# EAGLE board Rocket32_TRASIO (EAGLE 9.6.2)
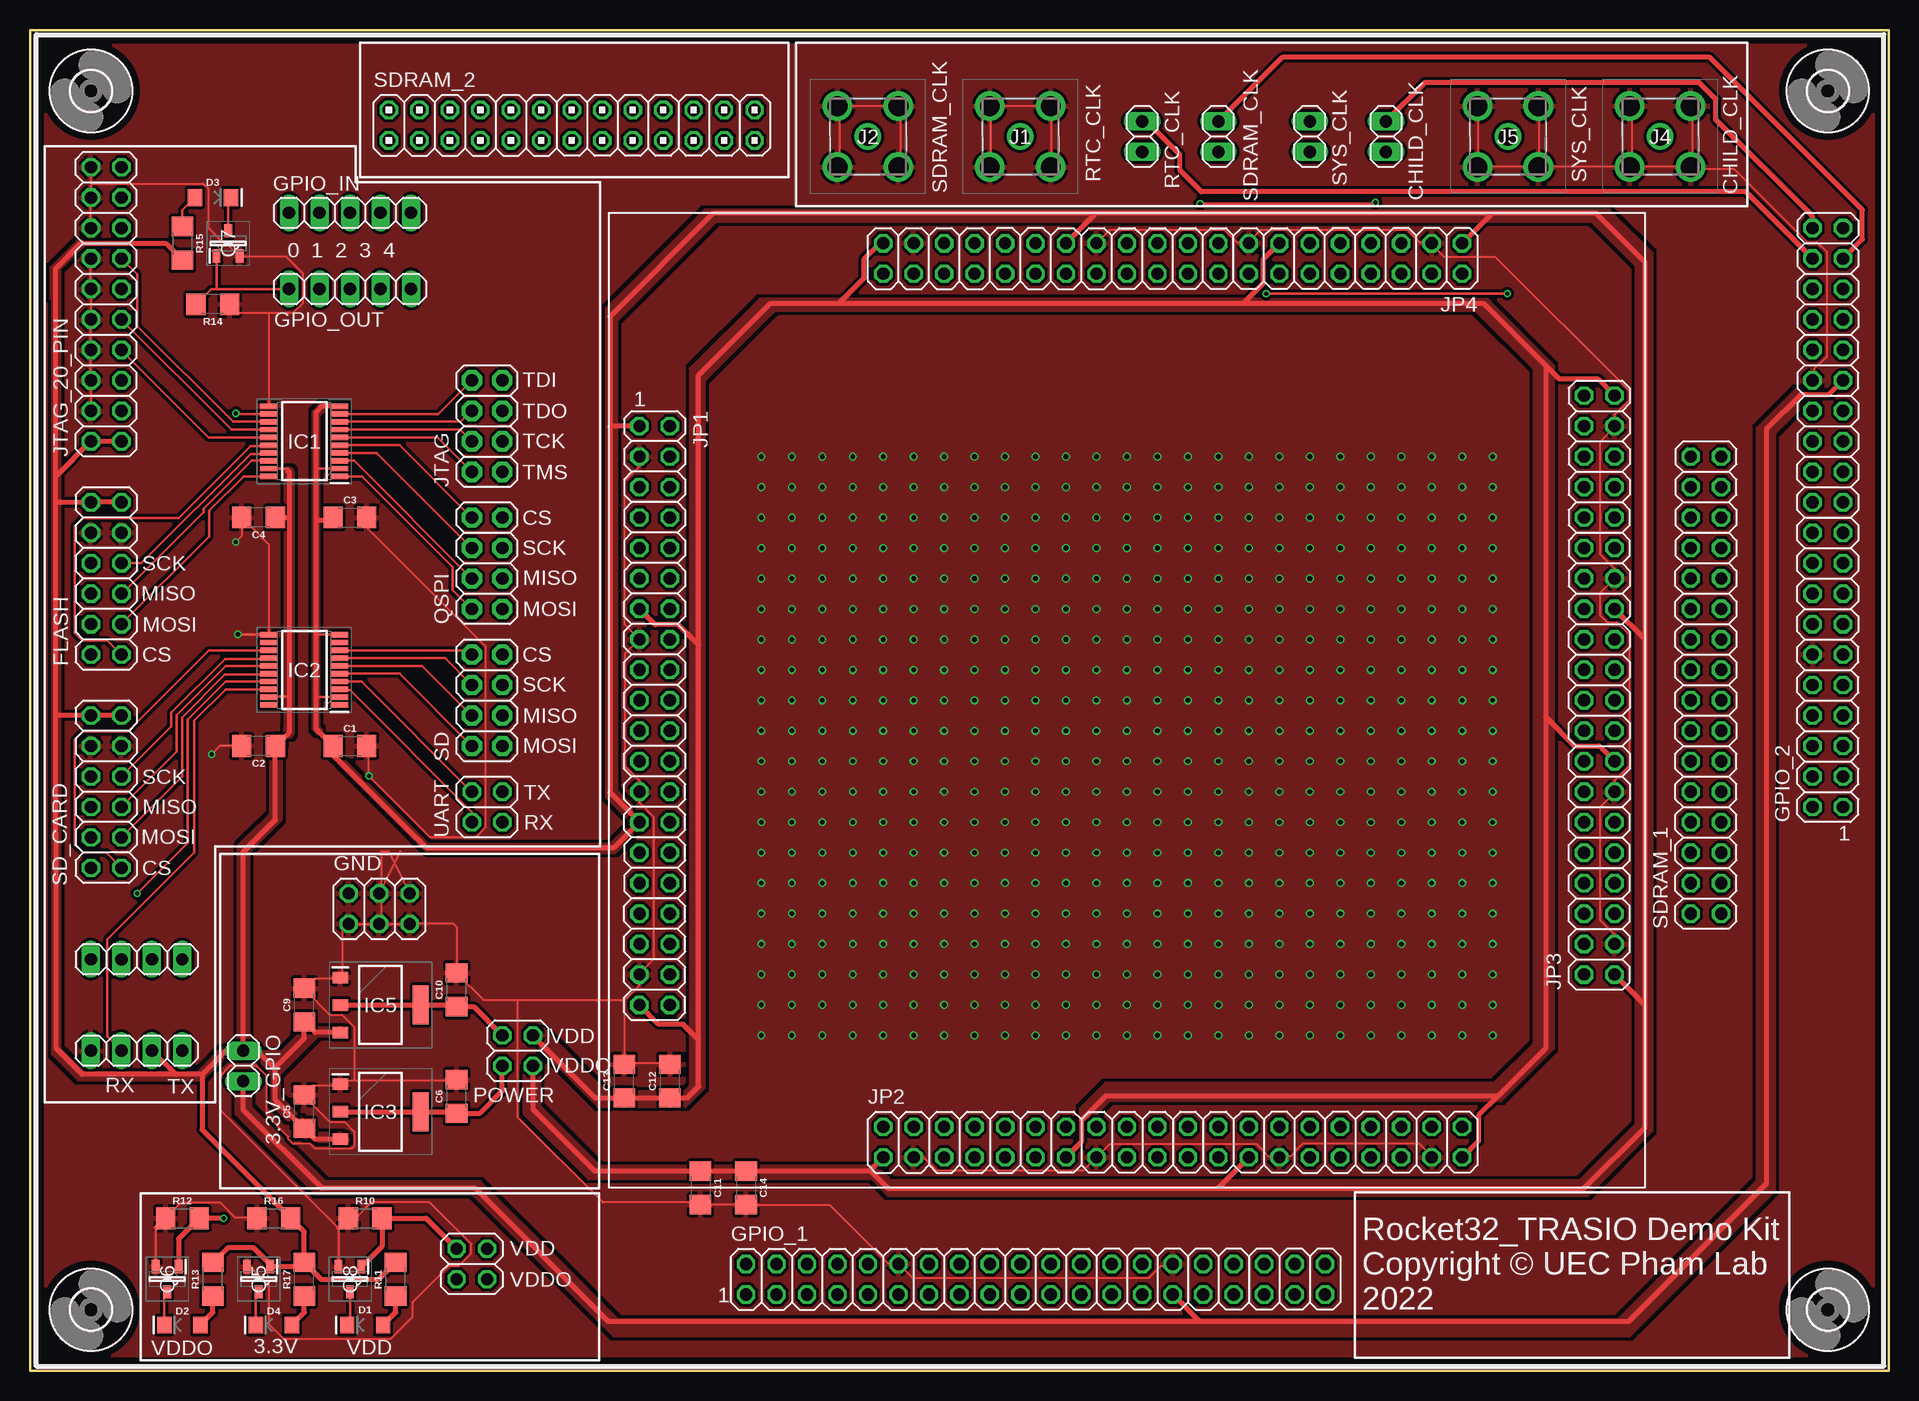
[diagram p2: board, top side]
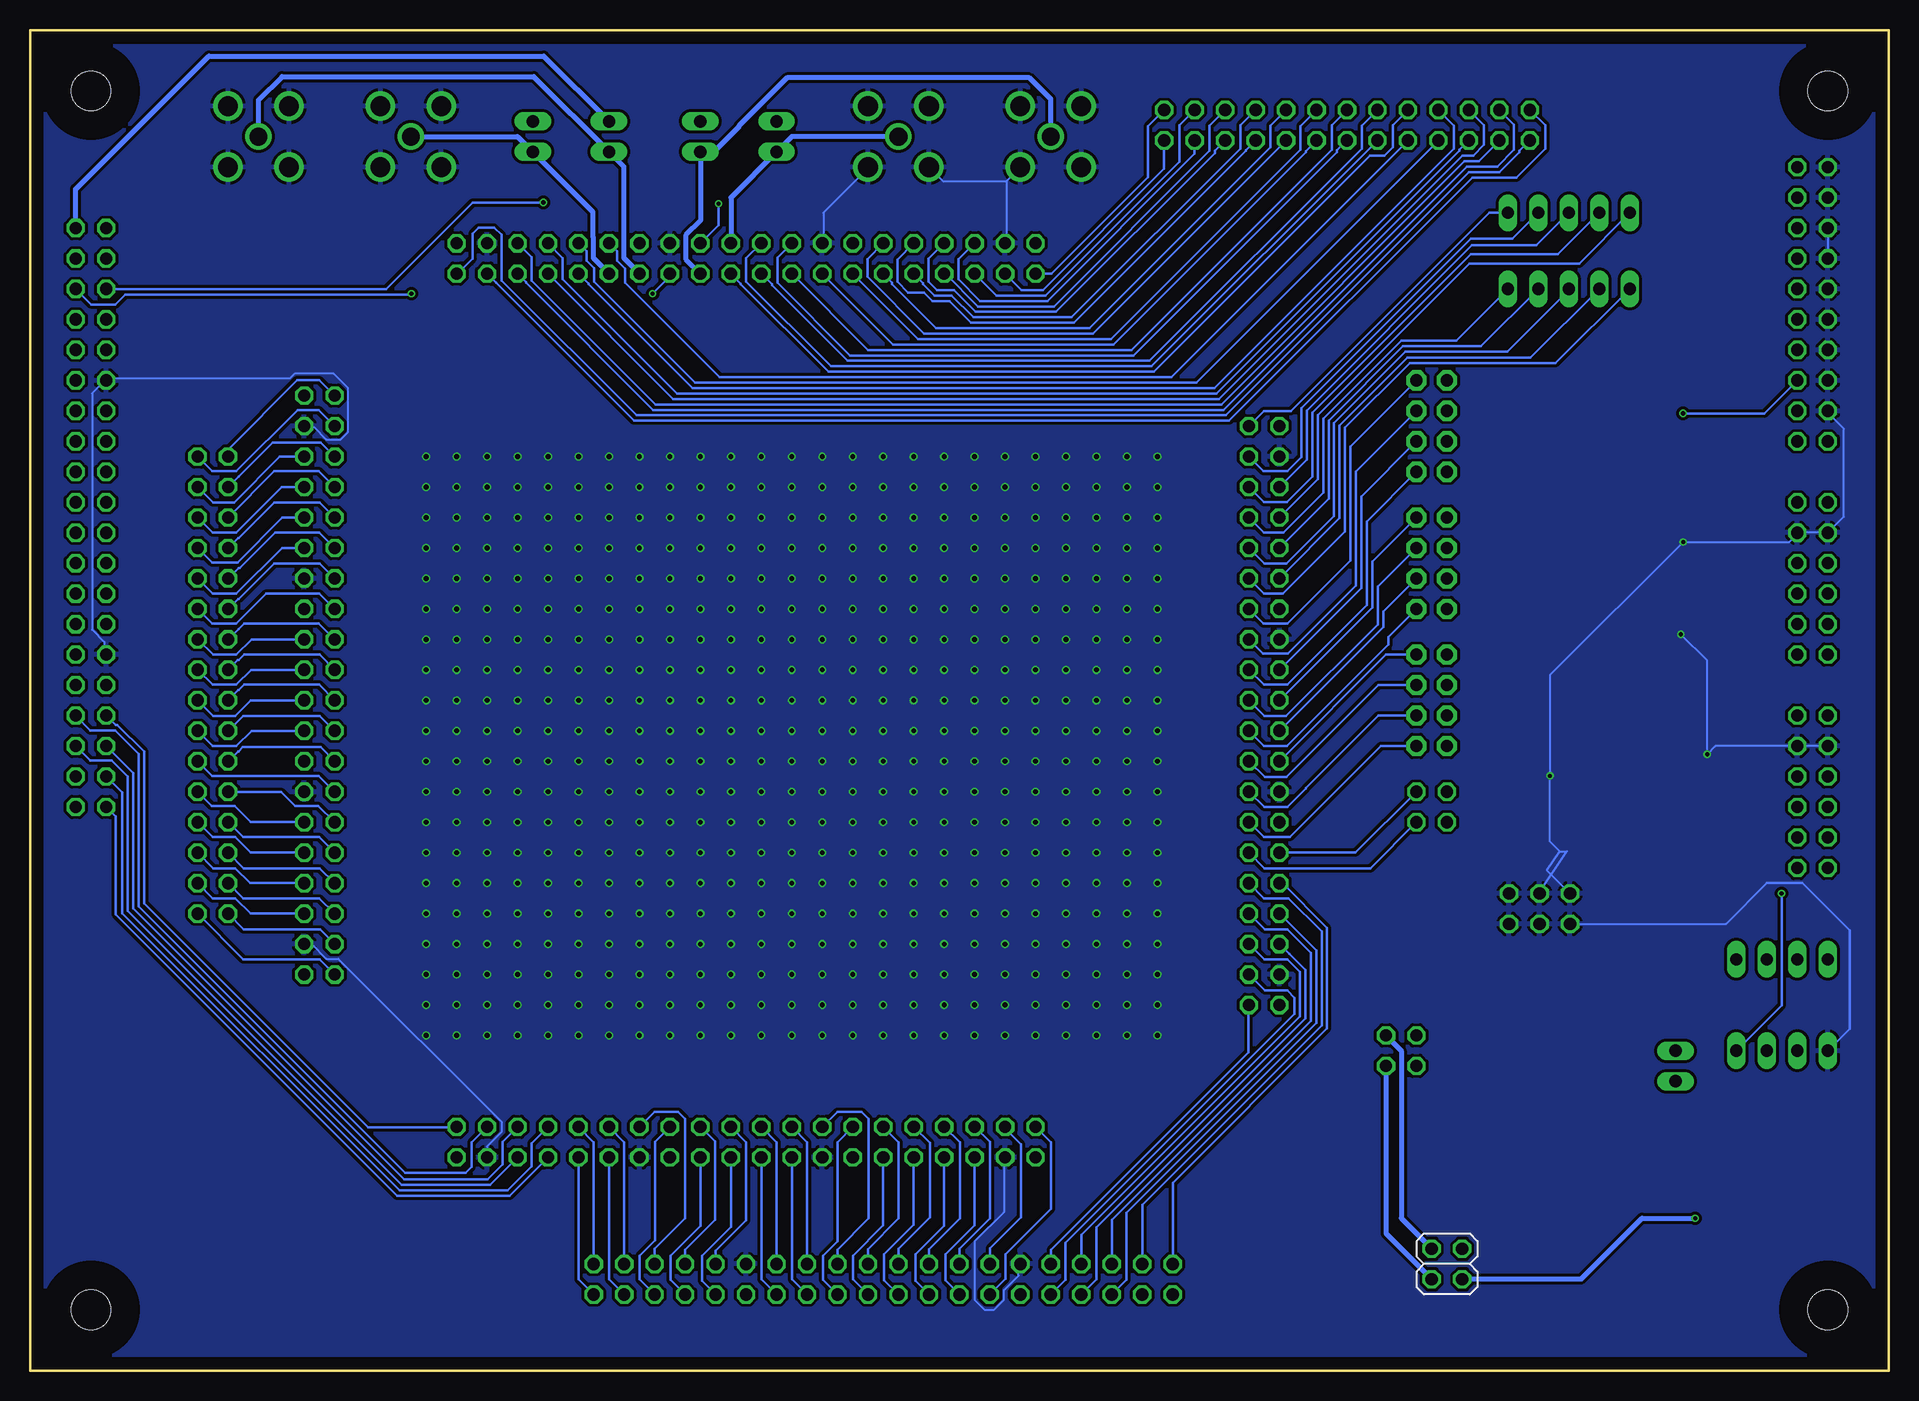
[diagram p3: board, bottom side, seen from below]

Size 154.94 x 111.76 mm. Coordinates in mm from the lower left corner, seen from the top.
Outline: 154.94,111.76 0,111.76 0,0 154.94,0 154.94,111.76
Copper layers (1*16): Top 0.035mm / dielectric 1.5mm / Bottom 0.035mm
Design rules "default *": minimum track width 6mil, minimum drill 0.35mm, track to track 10mil, track to pad 10mil, pad to pad 6mil, via to via 10mil, smd to smd 10mil, copper to edge 40mil, drill to drill 6mil, minimum pad ring 0.13mm, minimum via ring 0.13mm, stop-mask expansion 4mil, vias tented up to drill 0mil, thermal gap 10mil

## Footprints (pad centres in the part's own frame; a part is rotated, then mirrored left to right if it is on the bottom)
1X02 = drill 1.016 long: 1 -1.27,0; 2 1.27,0
1206 = smd 1.6 x 1.8: 1 -1.4,0; 2 1.4,0
LED-1206 = smd 1.2 x 1.4: A -1.5,0; C 1.5,0
2X06 = drill 1.016 octagon: 1 -6.35,-1.27; 2 -6.35,1.27; 3 -3.81,-1.27; 4 -3.81,1.27; 5 -1.27,-1.27; 6 -1.27,1.27; 7 1.27,-1.27; 8 1.27,1.27; 9 3.81,-1.27; 10 3.81,1.27; 11 6.35,-1.27; 12 6.35,1.27
2X03 = drill 1.016 octagon: 1 -2.54,-1.27; 2 -2.54,1.27; 3 0,-1.27; 4 0,1.27; 5 2.54,-1.27; 6 2.54,1.27
2X20 = drill 1.016 octagon: 1 -24.13,-1.27; 2 -24.13,1.27; 3 -21.59,-1.27; 4 -21.59,1.27; 5 -19.05,-1.27; 6 -19.05,1.27; 7 -16.51,-1.27; 8 -16.51,1.27; 9 -13.97,-1.27; 10 -13.97,1.27; 11 -11.43,-1.27; 12 -11.43,1.27; 13 -8.89,-1.27; 14 -8.89,1.27; 15 -6.35,-1.27; 16 -6.35,1.27; 17 -3.81,-1.27; 18 -3.81,1.27; 19 -1.27,-1.27; 20 -1.27,1.27; 21 1.27,-1.27; 22 1.27,1.27; 23 3.81,-1.27; 24 3.81,1.27; 25 6.35,-1.27; 26 6.35,1.27; 27 8.89,-1.27; 28 8.89,1.27; 29 11.43,-1.27; 30 11.43,1.27; 31 13.97,-1.27; 32 13.97,1.27; 33 16.51,-1.27; 34 16.51,1.27; 35 19.05,-1.27; 36 19.05,1.27; 37 21.59,-1.27; 38 21.59,1.27; 39 24.13,-1.27; 40 24.13,1.27
1X05 = drill 1.016 long: 1 -5.08,0; 2 -2.54,0; 3 0,0; 4 2.54,0; 5 5.08,0
3,3 = hole 3.3: 0,0
SOP65P640X120-20N = smd 1.475 x 0.45: 1 -2.938,2.925; 2 -2.938,2.275; 3 -2.938,1.625; 4 -2.938,0.975; 5 -2.938,0.325; 6 -2.938,-0.325; 7 -2.938,-0.975; 8 -2.938,-1.625; 9 -2.938,-2.275; 10 -2.938,-2.925; 11 2.938,-2.925; 12 2.938,-2.275; 13 2.938,-1.625; 14 2.938,-0.975; 15 2.938,-0.325; 16 2.938,0.325; 17 2.938,0.975; 18 2.938,1.625; 19 2.938,2.275; 20 2.938,2.925
SOT229P700X180-4N = smd 1.3 x 0.95: 1 -3.35,2.29; 2 -3.35,0; 3 -3.35,-2.29 | smd 1.3 x 3.25: 4 3.35,0
29856004 = drill 1.64 pad 2.46: 1 0,0; 2 5.08,0; 3 5.08,5.08; 4 0,5.08 | drill 1.47 pad 2.205: 5 2.54,2.54
2X04 = drill 1.016 pad 1.676 octagon: 1 -3.81,-1.27; 2 -3.81,1.27; 3 -1.27,-1.27; 4 -1.27,1.27; 5 1.27,-1.27; 6 1.27,1.27; 7 3.81,-1.27; 8 3.81,1.27
2X10 = drill 1.016 octagon: 1 -11.43,-1.27; 2 -11.43,1.27; 3 -8.89,-1.27; 4 -8.89,1.27; 5 -6.35,-1.27; 6 -6.35,1.27; 7 -3.81,-1.27; 8 -3.81,1.27; 9 -1.27,-1.27; 10 -1.27,1.27; 11 1.27,-1.27; 12 1.27,1.27; 13 3.81,-1.27; 14 3.81,1.27; 15 6.35,-1.27; 16 6.35,1.27; 17 8.89,-1.27; 18 8.89,1.27; 19 11.43,-1.27; 20 11.43,1.27
2X02 = drill 1.016 octagon: 1 -1.27,-1.27; 2 -1.27,1.27; 3 1.27,-1.27; 4 1.27,1.27
SOT96P240X100-3N = smd 1.1 x 0.65: 1 -1.05,0.96; 2 -1.05,-0.96; 3 1.05,0
2X16 = drill 1.016 octagon: 1 -19.05,-1.27; 2 -19.05,1.27; 3 -16.51,-1.27; 4 -16.51,1.27; 5 -13.97,-1.27; 6 -13.97,1.27; 7 -11.43,-1.27; 8 -11.43,1.27; 9 -8.89,-1.27; 10 -8.89,1.27; 11 -6.35,-1.27; 12 -6.35,1.27; 13 -3.81,-1.27; 14 -3.81,1.27; 15 -1.27,-1.27; 16 -1.27,1.27; 17 1.27,-1.27; 18 1.27,1.27; 19 3.81,-1.27; 20 3.81,1.27; 21 6.35,-1.27; 22 6.35,1.27; 23 8.89,-1.27; 24 8.89,1.27; 25 11.43,-1.27; 26 11.43,1.27; 27 13.97,-1.27; 28 13.97,1.27; 29 16.51,-1.27; 30 16.51,1.27; 31 19.05,-1.27; 32 19.05,1.27
2X13 = drill 1.016 octagon: 1 -15.24,-1.27; 2 -15.24,1.27; 3 -12.7,-1.27; 4 -12.7,1.27; 5 -10.16,-1.27; 6 -10.16,1.27; 7 -7.62,-1.27; 8 -7.62,1.27; 9 -5.08,-1.27; 10 -5.08,1.27; 11 -2.54,-1.27; 12 -2.54,1.27; 13 0,-1.27; 14 0,1.27; 15 2.54,-1.27; 16 2.54,1.27; 17 5.08,-1.27; 18 5.08,1.27; 19 7.62,-1.27; 20 7.62,1.27; 21 10.16,-1.27; 22 10.16,1.27; 23 12.7,-1.27; 24 12.7,1.27; 25 15.24,-1.27; 26 15.24,1.27
1X04 = drill 1.016 long: 1 -3.81,0; 2 -1.27,0; 3 1.27,0; 4 3.81,0

## Placement (x,y rotation side)
3.3V_GPIO  [1X02]  17.78,25.4 270 top
C1  0.1uF  [1206]  26.67,52.07 0 top
C2  0.1uF  [1206]  19.05,52.07 180 top
C3  0.1uF  [1206]  26.67,71.12 0 top
C4  0.1uF  [1206]  19.05,71.12 180 top
C5  100uF  [1206]  22.86,21.59 90 top
C6  22uF  [1206]  35.56,22.86 90 top
C9  100uF  [1206]  22.86,30.48 90 top
C10  22uF  [1206]  35.56,31.75 90 top
C11  0.1uF  [1206]  55.88,15.24 270 top
C12  0.1uF  [1206]  53.34,24.13 90 top
C13  10uF  [1206]  49.53,24.13 90 top
C14  10uF  [1206]  59.69,15.24 270 top
CHILD_CLK  [1X02]  113.03,102.87 270 top
D1  [LED-1206]  27.94,3.81 180 top
D2  [LED-1206]  12.7,3.81 180 top
D3  [LED-1206]  15.24,97.79 0 top
D4  [LED-1206]  20.32,3.81 180 top
FLASH  PINHD-2X6  [2X06]  6.35,66.04 270 top
GND  PINHD-2X3  [2X03]  29.11,38.51 0 top
GPIO_1  [2X20]  83.82,7.62 0 top
GPIO_2  [2X20]  149.86,71.12 90 top
GPIO_IN  PINHD-1X5  [1X05]  26.67,96.52 0 top
GPIO_OUT  PINHD-1X5  [1X05]  26.67,90.17 0 top
H1  MOUNT-HOLE3.3  [3,3]  149.86,5.08 0 top
H2  MOUNT-HOLE3.3  [3,3]  149.86,106.68 0 top
H3  MOUNT-HOLE3.3  [3,3]  5.08,106.68 0 top
H4  MOUNT-HOLE3.3  [3,3]  5.08,5.08 0 top
IC1  TXB0108PWR  [SOP65P640X120-20N]  22.86,77.47 180 top
IC2  TXB0108PWR  [SOP65P640X120-20N]  22.86,58.42 180 top
IC3  AMS1117-1.8  [SOT229P700X180-4N]  29.21,21.59 0 top
IC5  AMS1117-1.8  [SOT229P700X180-4N]  29.21,30.48 0 top
J1  2985-6004  [29856004]  80.01,100.33 0 top
J2  2985-6004  [29856004]  67.31,100.33 0 top
J4  2985-6004  [29856004]  133.35,100.33 0 top
J5  2985-6004  [29856004]  120.65,100.33 0 top
JP1  [2X20]  52.07,54.61 270 top
JP2  [2X20]  95.25,19.05 0 top
JP3  [2X20]  130.81,57.15 90 top
JP4  [2X20]  95.25,92.71 180 top
JTAG  [2X04]  38.1,78.74 90 top
JTAG_20_PIN  [2X10]  6.35,88.9 90 top
POWER  [2X02]  40.64,26.67 270 top
POWER_LED  [2X02]  36.83,8.89 270 bottom
Q5  2N7002K-7  [SOT96P240X100-3N]  19.05,7.62 270 top
Q6  2N7002K-7  [SOT96P240X100-3N]  11.43,7.62 270 top
Q7  2N7002K-7  [SOT96P240X100-3N]  16.51,93.98 90 top
Q8  2N7002K-7  [SOT96P240X100-3N]  26.67,7.62 270 top
QSPI  [2X04]  38.1,67.31 90 top
R10  10k  [1206]  27.94,12.7 0 top
R11  330  [1206]  30.48,7.62 90 top
R12  10k  [1206]  12.7,12.7 0 top
R13  330  [1206]  15.24,7.62 90 top
R14  10k  [1206]  15.24,88.9 180 top
R15  330  [1206]  12.7,93.98 270 top
R16  10k  [1206]  20.32,12.7 0 top
R17  330  [1206]  22.86,7.62 90 top
RTC_CLK  [1X02]  92.71,102.87 270 top
SD  [2X04]  38.1,55.88 90 top
SD_CARD  PINHD-2X6  [2X06]  6.35,48.26 270 top
SDRAM_1  [2X16]  139.7,57.15 90 top
SDRAM_2  [2X13]  45.16,103.82 0 top
SDRAM_CLK  [1X02]  99.06,102.87 270 top
SYS_CLK  [1X02]  106.68,102.87 270 top
UART  PINHD-2X2  [2X02]  38.1,46.99 90 top
USB-UART_1  PINHD-1X4  [1X04]  8.89,26.67 0 top
USB-UART_2  PINHD-1X4  [1X04]  8.89,34.29 0 top

## Tracks (layer width: path | path; a pad name or v marks a point on that pad's centre or on a via)
CHILDCLOCK
  Bottom 0.406: J5.5 114.3,102.87 CHILD_CLK.2 108.04,96.61 108.04,94.52 108,94.48 108,92.76 JP4.12
CHILDCLOCK_GPIO
  Top 0.406: CHILD_CLK.1 116.27,107.38 139.14,107.38 140.54,105.98 140.54,104.28 148.59,96.23 GPIO_2.40
CLOCK_GPIO
  Bottom 0.406: GPIO_2.39 151.13,98.49 140.04,109.58 112.12,109.58 SYS_CLK.1
CS
  Top 0.2: IC2.13 14.91,60.05 8.14,53.28 4.44,53.28 3.74,52.58 3.74,43.88 4.44,43.18 6.35,43.18 SD_CARD.12
EXTSER_IN_BITS[0]
  Bottom 0.2: GPIO_1.36 102.87,10.15 100.34,12.68 100.34,20.98 100.94,21.58 102.88,21.58 JP2.28
EXTSER_IN_BITS[1]
  Bottom 0.2: JP2.26 102.84,19.08 102.84,10.88 104.14,9.58 104.14,7.62 GPIO_1.35
EXTSER_IN_BITS[2]
  Bottom 0.2: GPIO_1.34 100.33,10.09 97.84,12.58 97.84,19.1 JP2.24
EXTSER_IN_BITS[3]
  Bottom 0.2: GPIO_1.33 101.54,7.56 101.54,9.58 99.06,12.06 JP2.23
EXTSER_IN_BITS[4]
  Bottom 0.2: GPIO_1.32 97.79,9.99 95.24,12.54 95.24,19.04 JP2.22
EXTSER_IN_BITS[5]
  Bottom 0.2: JP2.21 96.52,12 98.94,9.58 98.94,7.5 GPIO_1.31
EXTSER_IN_BITS[6]
  Bottom 0.2: GPIO_1.28 92.71,19.05 JP2.20
EXTSER_IN_BITS[7]
  Bottom 0.2: JP2.19 93.98,7.62 GPIO_1.27
EXTSER_IN_READY
  Bottom 0.2: JP2.17 91.44,7.62 GPIO_1.25
EXTSER_IN_VALID
  Bottom 0.2: GPIO_1.26 90.17,19.05 JP2.18
EXTSER_OUT_BITS[0]
  Bottom 0.2: GPIO_2.8 147.81,53.83 147.65,53.83 145.42,51.61 145.42,38.96 126.74,20.28 119.42,20.28 JP2.40
EXTSER_OUT_BITS[1]
  Bottom 0.2: JP2.38 118.14,19.02 118.14,16.98 118.64,16.48 123.66,16.48 145.88,38.7 145.88,51.42 147.84,53.38 149.9,53.38 GPIO_2.7
EXTSER_OUT_BITS[2]
  Bottom 0.2: JP2.36 115.54,19.08 115.54,17.18 116.78,15.94 123.76,15.94 146.33,38.51 146.33,49.81 GPIO_2.6
EXTSER_OUT_BITS[3]
  Bottom 0.2: JP2.35 116.59,15.49 123.95,15.49 146.79,38.32 146.79,49.53 148.14,50.88 149.94,50.88 GPIO_2.5
EXTSER_OUT_BITS[4]
  Bottom 0.2: JP2.34 113.14,18.94 113.14,17.04 115.15,15.03 124.14,15.03 147.24,38.13 147.24,48.18 GPIO_2.4
EXTSER_OUT_BITS[5]
  Bottom 0.2: JP2.33 114.96,14.58 124.34,14.58 147.79,38.03 147.79,46.19 GPIO_2.2
EXTSER_OUT_BITS[6]
  Bottom 0.2: GPIO_1.40 107.95,19.05 JP2.32
EXTSER_OUT_BITS[7]
  Bottom 0.2: JP2.31 109.22,7.62 GPIO_1.39
EXTSER_OUT_READY
  Bottom 0.2: JP2.29 106.68,7.62 GPIO_1.37
EXTSER_OUT_VALID
  Bottom 0.2: GPIO_1.38 105.41,19.05 JP2.30
FLASH_CS
  Top 0.2: IC1.16 19.85,77.07 18.41,77.07 12.41,71.08 4.44,71.08 3.74,70.38 3.74,61.48 4.34,60.88 6.43,60.88 FLASH.12
FLASH_MISO
  Top 0.2: IC1.18 18.46,75.84 14.49,71.87 14.49,71.58 7.68,64.77 FLASH.8
FLASH_MOSI
  Top 0.2: IC1.20 17.8,74.55 14.94,71.68 14.94,69.55 FLASH.10
FLASH_QSPI_CS
  Bottom 0.2: JP1.19 43.06,63.62 43.06,67.43 QSPI.7
FLASH_QSPI_MISO
  Bottom 0.2: JP1.21 42.15,61.99 42.15,63.26 QSPI.3
FLASH_QSPI_MOSI
  Bottom 0.2: JP1.22 52.08,52.08 50.16,52.08 41.69,60.55 41.69,61.18 QSPI.1
FLASH_QSPI_SCK
  Bottom 0.2: JP1.20 52.04,54.58 50.24,54.58 42.6,62.22 42.6,65.35 QSPI.5
FLASH_SCK
  Top 0.2: IC1.17 19.85,76.42 18.4,76.42 9.29,67.31 FLASH.6
GND  (via drill 0.35, 0.4)
  Top 0.152: JP1.3 50.8,75.39 49.58,74.17 49.58,62.18 JP1.15 49.58,59.74 49.58,50.39 50.8,49.17 JP1.25 50.8,47.35 52.02,46.13 52.02,34.34 50.8,33.12 JP1.37 50.8,32.11 49.58,30.89 | 49.58,25.6 53.24,25.6 C12.2 | 49.58,25.6 49.58,30.89 | 49.58,25.6 C13.2 | 40.64,30.89 37.79,30.89 35.56,33.12 C10.2 35.56,36.98 35.3,37.24 GND.5 29.26,37.24 | 40.64,30.89 49.58,30.89 | IC2.11 19.91,61.37 19.91,68.89 17.68,71.12 C4.2 17.65,69.59 v17.14,69.08 | 17.47,92.86 21.34,92.86 22.76,91.44 22.76,89 21.95,88.19 19.91,88.19 | 19.91,88.19 17.27,88.19 16.66,88.8 R14.1 | 19.91,88.19 19.91,80.47 IC1.11 | JTAG_20_PIN.20 5.08,98.96 | 5.08,98.96 JTAG_20_PIN.18 JTAG_20_PIN.16 | JTAG_20_PIN.4 JTAG_20_PIN.6 JTAG_20_PIN.8 JTAG_20_PIN.10 JTAG_20_PIN.12 JTAG_20_PIN.14 | 17.27,93.07 16.26,94.08 16.05,94.08 14.83,95.3 14.83,98.55 14.43,98.96 5.08,98.96 | R16.1 18.9,12.8 17.07,12.8 15.85,14.02 12.6,14.02 11.38,12.8 R12.1 | 18.29,8.74 19.91,7.11 19.91,3.86 21.13,2.64 30.07,2.64 31.9,4.47 31.9,5.69 34.95,8.74 35.76,8.74 36.78,9.75 36.78,10.57 33.32,14.02 28.45,14.02 27.23,12.8 26.62,12.8 R10.1 | 27.03,24.18 26.21,24.18 26.01,23.98 IC3.1 25.81,23.77 23.57,23.77 22.96,23.16 C5.2 22.76,22.96 24.99,20.73 26.21,20.73 27.03,19.91 27.03,18.69 26.82,18.49 23.77,18.49 23.37,18.9 21.95,18.9 21.54,19.3 21.54,19.51 19.71,21.34 19.71,24.59 18.9,25.4 16.66,25.4 15.85,24.59 15.85,21.74 25.6,11.99 25.72,11.88 | 27.03,24.18 35.56,24.18 C6.2 | 27.03,24.18 27.03,28.65 26.01,29.67 24.99,29.67 22.96,31.7 C9.2 22.96,31.9 23.77,32.72 25.81,32.72 IC5.1 26.01,32.92 26.01,37.24 GND.1 GND.3 29.26,37.24 | C1.2 28.24,52.02 v28.24,49.58 33.32,44.5 37.19,44.5 38,45.31 38,60.35 28.24,70.1 28.24,71.12 C3.2
  Top 0.152: 29.26,43.28 29.9,43.28 GND.6 | 30.86,43.28 GND.4 29.11,40.57 | 29.26,43.08 29.26,37.24 | 120.7,100.38 120.7,105.26 J5.4 | 125.78,100.38 125.78,105.26 J5.3 | 120.7,100.38 125.58,100.38 J5.2 125.78,100.38 | 120.7,100.38 J5.1 | 133.5,100.38 133.5,105.26 J4.4 | J4.2 138.58,100.38 138.58,105.26 J4.3 | 133.5,100.38 138.38,100.38 J4.2 | 133.5,100.38 J4.1 133.3,100.38 125.78,100.38 | GPIO_2.30 148.74,82.7 148.74,83.52 149.76,84.53 149.76,93.27 148.95,94.08 148.13,94.08 142.04,100.18 138.58,100.18 J4.2 | GPIO_1.30 95.1,8.74 94.28,8.74 93.27,7.72 73.56,7.72 GPIO_1.12 72.34,8.94 71.53,8.94 66.65,13.82 59.74,13.82 C14.2 59.54,13.82 55.88,13.82 C11.2 55.88,14.02 47.75,14.02 40.64,21.13 40.64,30.89 | JP2.37 116.84,17.88 115.82,18.9 106.07,18.9 105.05,17.88 104.24,17.88 JP2.27 104.04,17.88 103.23,17.88 102.21,18.9 90.02,18.9 JP2.15 87.78,16.66 75.59,16.66 74.57,17.68 73.76,17.68 JP2.3 | JP3.3 132.08,36.37 130.86,37.59 130.86,46.94 132.08,48.16 JP3.13 132.08,49.17 133.3,50.39 133.3,61.37 132.28,62.38 131.47,62.38 130.86,62.99 130.86,64.82 JP3.27 132.08,66.85 130.86,68.07 130.86,77.42 132.08,78.64 JP3.37 132.08,79.65 133.3,80.87 133.3,81.69 122.12,92.86 117.86,92.86 116.84,93.88 JP4.3 116.84,94.08 115.82,94.08 114.81,95.1 102.62,95.1 101.6,94.08 | J2.1 67.46,100.38 67.46,105.26 J2.4 67.46,105.46 72.34,105.46 J2.3 72.54,105.26 72.54,100.38 J2.2 | J1.1 80.06,100.38 80.06,105.26 J1.4 80.06,105.46 84.94,105.46 J1.3 85.14,105.26 85.14,100.38 J1.2 | 101.6,94.08 100.58,94.08 99.57,95.1 90.02,95.1 JP4.25 | 101.6,94.08 JP4.15 | C2.2 15.83,52.07 v15.14,51.38
  Top 0.2: IC2.11 17.38,61.34 v17.34,61.38 | R10.1 25.71,11.87 Q8.2 | 10.48,11.88 10.47,11.87 Q6.2
  Top 0.406: R12.1 10.48,11.88 | R10.1 25.72,11.88
  Bottom 0.152: JTAG_20_PIN.16 JTAG_20_PIN.14 | JTAG_20_PIN.4 5.08,79.86 3.74,78.52 3.74,71.19 FLASH.3 7.54,69.85 | GND.4 29.11,39.85 26.82,43.28 27.43,43.28 | 27.43,43.28 28.24,44.09 v28.24,49.58 28.24,57.98 v17.14,69.08 8.31,69.08 7.54,69.85 | GND.2 28.49,41.7 27.43,43.28 | GND.1 13.56,37.24 10.16,40.64 | GPIO_2.12 148.74,59.74 148.74,60.76 149.76,61.77 149.76,81.48 148.74,82.5 GPIO_2.30 148.54,82.7 133.3,82.7 132.89,83.11 129.64,83.11 128.42,81.89 128.42,78.23 129.03,77.62 130.25,77.62 131.27,78.64 132.08,78.64 JP3.37 | GPIO_1.12 72.54,8.74 72.54,7.93 73.76,6.71 73.76,5.89 74.57,5.08 75.39,5.08 76.2,5.89 76.2,10.77 73.76,13.21 73.76,17.68 JP2.3 | 73.56,99.16 73.56,94.08 JP4.37 | J2.2 73.56,99.16 | JP4.25 88.8,94.08 88.8,96.52 85.14,100.18 J1.2 | 73.56,99.16 78.84,99.16 J1.1 | JP2.37 116.84,18.69 115.62,19.91 115.62,20.73 129.24,34.34 130.25,34.34 131.47,35.56 JP3.3 | SD_CARD.3 SD_CARD.4 14.45,52.07 v15.14,51.38 15.14,59.18 v17.34,61.38 | 7.54,69.85 FLASH.4
  Bottom 0.2: USB-UART_1.1 3.24,28.51 3.24,36.68 7.2,40.64 10.16,40.64
  other vias: 60.96,27.94 63.5,27.94 66.04,27.94 68.58,27.94 71.12,27.94 71.12,30.48 68.58,30.48 66.04,30.48 63.5,30.48 60.96,30.48 60.96,33.02 63.5,33.02 66.04,33.02 68.58,33.02 71.12,33.02 71.12,35.56 68.58,35.56 66.04,35.56 63.5,35.56 60.96,35.56 111.76,27.94 114.3,27.94 116.84,27.94 119.38,27.94 121.92,27.94 121.92,30.48 119.38,30.48 116.84,30.48 114.3,30.48 111.76,30.48 111.76,33.02 114.3,33.02 116.84,33.02 119.38,33.02 121.92,33.02 121.92,35.56 119.38,35.56 116.84,35.56 114.3,35.56 111.76,35.56 99.06,27.94 101.6,27.94 104.14,27.94 106.68,27.94 109.22,27.94 109.22,30.48 106.68,30.48 104.14,30.48 101.6,30.48 99.06,30.48 99.06,33.02 101.6,33.02 104.14,33.02 106.68,33.02 109.22,33.02 109.22,35.56 106.68,35.56 104.14,35.56 101.6,35.56 99.06,35.56 86.36,27.94 88.9,27.94 91.44,27.94 93.98,27.94 96.52,27.94 96.52,30.48 93.98,30.48 91.44,30.48 88.9,30.48 86.36,30.48 86.36,33.02 88.9,33.02 91.44,33.02 93.98,33.02 96.52,33.02 96.52,35.56 93.98,35.56 91.44,35.56 88.9,35.56 86.36,35.56 73.66,27.94 76.2,27.94 78.74,27.94 81.28,27.94 83.82,27.94 83.82,30.48 81.28,30.48 78.74,30.48 76.2,30.48 73.66,30.48 73.66,33.02 76.2,33.02 78.74,33.02 81.28,33.02 83.82,33.02 83.82,35.56 81.28,35.56 78.74,35.56 76.2,35.56 73.66,35.56 60.96,38.1 63.5,38.1 66.04,38.1 68.58,38.1 71.12,38.1 71.12,40.64 68.58,40.64 66.04,40.64 63.5,40.64 60.96,40.64 60.96,43.18 63.5,43.18 66.04,43.18 68.58,43.18 71.12,43.18 71.12,45.72 68.58,45.72 66.04,45.72 63.5,45.72 60.96,45.72 111.76,38.1 114.3,38.1 116.84,38.1 119.38,38.1 121.92,38.1 121.92,40.64 119.38,40.64 116.84,40.64 114.3,40.64 111.76,40.64 111.76,43.18 114.3,43.18 116.84,43.18 119.38,43.18 121.92,43.18 121.92,45.72 119.38,45.72 116.84,45.72 114.3,45.72 111.76,45.72 99.06,38.1 101.6,38.1 104.14,38.1 106.68,38.1 109.22,38.1 109.22,40.64 106.68,40.64 104.14,40.64 101.6,40.64 99.06,40.64 99.06,43.18 101.6,43.18 104.14,43.18 106.68,43.18 109.22,43.18 109.22,45.72 106.68,45.72 104.14,45.72 101.6,45.72 99.06,45.72 86.36,38.1 88.9,38.1 91.44,38.1 93.98,38.1 96.52,38.1 96.52,40.64 93.98,40.64 91.44,40.64 88.9,40.64 86.36,40.64 86.36,43.18 88.9,43.18 91.44,43.18 93.98,43.18 96.52,43.18 96.52,45.72 93.98,45.72 91.44,45.72 88.9,45.72 86.36,45.72 73.66,38.1 76.2,38.1 78.74,38.1 81.28,38.1 83.82,38.1 83.82,40.64 81.28,40.64 78.74,40.64 76.2,40.64 73.66,40.64 73.66,43.18 76.2,43.18 78.74,43.18 81.28,43.18 83.82,43.18 83.82,45.72 81.28,45.72 78.74,45.72 76.2,45.72 73.66,45.72 60.96,48.26 63.5,48.26 66.04,48.26 68.58,48.26 71.12,48.26 71.12,50.8 68.58,50.8 66.04,50.8 63.5,50.8 60.96,50.8 60.96,53.34 63.5,53.34 66.04,53.34 68.58,53.34 71.12,53.34 71.12,55.88 68.58,55.88 66.04,55.88 63.5,55.88 60.96,55.88 111.76,48.26 114.3,48.26 116.84,48.26 119.38,48.26 121.92,48.26 121.92,50.8 119.38,50.8 116.84,50.8 114.3,50.8 111.76,50.8 111.76,53.34 114.3,53.34 116.84,53.34 119.38,53.34 121.92,53.34 121.92,55.88 119.38,55.88 116.84,55.88 114.3,55.88 111.76,55.88 99.06,48.26 101.6,48.26 104.14,48.26 106.68,48.26 109.22,48.26 109.22,50.8 106.68,50.8 104.14,50.8 101.6,50.8 99.06,50.8 99.06,53.34 101.6,53.34 104.14,53.34 106.68,53.34 109.22,53.34 109.22,55.88 106.68,55.88 104.14,55.88 101.6,55.88 99.06,55.88 86.36,48.26 88.9,48.26 91.44,48.26 93.98,48.26 96.52,48.26 96.52,50.8 93.98,50.8 91.44,50.8 88.9,50.8 86.36,50.8 86.36,53.34 88.9,53.34 91.44,53.34 93.98,53.34 96.52,53.34 96.52,55.88 93.98,55.88 91.44,55.88 88.9,55.88 86.36,55.88 73.66,48.26 76.2,48.26 78.74,48.26 81.28,48.26 83.82,48.26 83.82,50.8 81.28,50.8 78.74,50.8 76.2,50.8 73.66,50.8 73.66,53.34 76.2,53.34 78.74,53.34 81.28,53.34 83.82,53.34 83.82,55.88 81.28,55.88 78.74,55.88 76.2,55.88 73.66,55.88 60.96,58.42 63.5,58.42 66.04,58.42 68.58,58.42 71.12,58.42 71.12,60.96 68.58,60.96 66.04,60.96 63.5,60.96 60.96,60.96 60.96,63.5 63.5,63.5 66.04,63.5 68.58,63.5 71.12,63.5 71.12,66.04 68.58,66.04 66.04,66.04 63.5,66.04 60.96,66.04 111.76,58.42 114.3,58.42 116.84,58.42 119.38,58.42 121.92,58.42 121.92,60.96 119.38,60.96 116.84,60.96 114.3,60.96 111.76,60.96 111.76,63.5 114.3,63.5 116.84,63.5 119.38,63.5 121.92,63.5 121.92,66.04 119.38,66.04 116.84,66.04 114.3,66.04 111.76,66.04 99.06,58.42 101.6,58.42 104.14,58.42 106.68,58.42 109.22,58.42 109.22,60.96 106.68,60.96 104.14,60.96 101.6,60.96 99.06,60.96 99.06,63.5 101.6,63.5 104.14,63.5 106.68,63.5 109.22,63.5 109.22,66.04 106.68,66.04 104.14,66.04 101.6,66.04 99.06,66.04 86.36,58.42 88.9,58.42 91.44,58.42 93.98,58.42 96.52,58.42 96.52,60.96 93.98,60.96 91.44,60.96 88.9,60.96 86.36,60.96 86.36,63.5 88.9,63.5 91.44,63.5 93.98,63.5 96.52,63.5 96.52,66.04 93.98,66.04 91.44,66.04 88.9,66.04 86.36,66.04 73.66,58.42 76.2,58.42 78.74,58.42 81.28,58.42 83.82,58.42 83.82,60.96 81.28,60.96 78.74,60.96 76.2,60.96 73.66,60.96 73.66,63.5 76.2,63.5 78.74,63.5 81.28,63.5 83.82,63.5 83.82,66.04 81.28,66.04 78.74,66.04 76.2,66.04 73.66,66.04 60.96,68.58 63.5,68.58 66.04,68.58 68.58,68.58 71.12,68.58 71.12,71.12 68.58,71.12 66.04,71.12 63.5,71.12 60.96,71.12 60.96,73.66 63.5,73.66 66.04,73.66 68.58,73.66 71.12,73.66 71.12,76.2 68.58,76.2 66.04,76.2 63.5,76.2 60.96,76.2 111.76,68.58 114.3,68.58 116.84,68.58 119.38,68.58 121.92,68.58 121.92,71.12 119.38,71.12 116.84,71.12 114.3,71.12 111.76,71.12 111.76,73.66 114.3,73.66 116.84,73.66 119.38,73.66 121.92,73.66 121.92,76.2 119.38,76.2 116.84,76.2 114.3,76.2 111.76,76.2 99.06,68.58 101.6,68.58 104.14,68.58 106.68,68.58 109.22,68.58 109.22,71.12 106.68,71.12 104.14,71.12 101.6,71.12 99.06,71.12 99.06,73.66 101.6,73.66 104.14,73.66 106.68,73.66 109.22,73.66 109.22,76.2 106.68,76.2 104.14,76.2 101.6,76.2 99.06,76.2 86.36,68.58 88.9,68.58 91.44,68.58 93.98,68.58 96.52,68.58 96.52,71.12 93.98,71.12 91.44,71.12 88.9,71.12 86.36,71.12 86.36,73.66 88.9,73.66 91.44,73.66 93.98,73.66 96.52,73.66 96.52,76.2 93.98,76.2 91.44,76.2 88.9,76.2 86.36,76.2 73.66,68.58 76.2,68.58 78.74,68.58 81.28,68.58 83.82,68.58 83.82,71.12 81.28,71.12 78.74,71.12 76.2,71.12 73.66,71.12 73.66,73.66 76.2,73.66 78.74,73.66 81.28,73.66 83.82,73.66 83.82,76.2 81.28,76.2 78.74,76.2 76.2,76.2 73.66,76.2
  pour Top (rank 2): 0.04,0.08 154.84,0.08 154.84,111.68 0.04,111.68
  pour Bottom (rank 2): 0.04,-0.02 154.84,-0.02 154.84,111.68 0.04,111.68
GPIO_IN[0]
  Bottom 0.2: JP1.7 47.6,74.32 47.6,79.66 34.96,92.3 25.81,92.3 GPIO_IN.1
GPIO_IN[1]
  Bottom 0.2: JP1.6 52.08,72.4 50.16,72.4 48.05,74.51 48.05,79.85 34.85,93.05 27.6,93.05 GPIO_IN.2
GPIO_IN[2]
  Bottom 0.2: JP1.5 48.5,75.96 48.5,80.04 34.74,93.81 29.38,93.81 GPIO_IN.3
GPIO_IN[3]
  Bottom 0.2: JP1.4 52.12,74.98 50.14,74.98 48.96,76.16 48.96,80.23 34.82,94.36 31.37,94.36 GPIO_IN.4
GPIO_IN[4]
  Bottom 0.2: GPIO_IN.5 33.31,96.52 49.85,79.98 52.1,79.98 JP1.2
GPIO_OUT[0]
  Top 0.2: GPIO_OUT.1 15.61,90.17 | 15.61,90.17 15.11,90.17 R14.2 | Q7.1 15.55,90.23 15.61,90.17
  Bottom 0.2: JP1.12 52.08,64.78 50.48,64.78 45.33,69.94 45.33,78.59 39.94,83.98 27.78,83.98 GPIO_OUT.1
GPIO_OUT[1]
  Bottom 0.2: JP1.11 45.78,71.06 45.78,78.78 40.13,84.43 29.87,84.43 GPIO_OUT.2
GPIO_OUT[2]
  Bottom 0.2: JP1.10 52.04,67.28 50.2,67.28 46.23,71.25 46.23,79 40.3,84.94 31.8,84.94 26.67,90.07 GPIO_OUT.3
GPIO_OUT[3]
  Bottom 0.2: JP1.9 46.69,72.69 46.69,79.19 40.48,85.39 33.99,85.39 GPIO_OUT.4
GPIO_OUT[4]
  Bottom 0.2: JP1.8 52.1,69.88 50.46,69.88 47.14,73.2 47.14,79.38 40.64,85.88 36.04,85.88 GPIO_OUT.5
JRST_N  (via drill 0.35)
  Top 0.2: v112.14,97.38 112.04,97.28 v97.54,97.28
  Bottom 0.2: GPIO_2.36 125.25,90.17 118.04,97.38 v112.14,97.38 | v97.54,97.28 97.54,95.5 JP4.17
JTAG_TCK
  Bottom 0.2: JP1.17 43.96,65.26 43.96,72.88 JTAG.3
JTAG_TDI
  Bottom 0.2: JP1.14 52.12,62.28 50.14,62.28 44.87,67.55 44.87,77.05 JTAG.7
JTAG_TDO
  Bottom 0.2: JP1.16 52.16,59.78 50.08,59.78 44.42,65.44 44.42,74.96 JTAG.5
JTAG_TMS
  Bottom 0.2: JP1.18 52.1,57.18 50.14,57.18 43.51,63.81 43.51,70.79 JTAG.1
MEMSER_IN_BITS[0]
  Bottom 0.2: GPIO_1.14 74.93,10.19 72.34,12.78 72.34,18.88 73.66,20.2 JP2.4
MEMSER_IN_BITS[1]
  Bottom 0.2: GPIO_1.13 73.64,7.64 73.64,9.68 69.84,13.48 69.84,19.04 JP2.2
MEMSER_IN_BITS[2]
  Bottom 0.2: JP1.40 53.39,30.43 53.39,26.53 69.85,10.07 GPIO_1.10
MEMSER_IN_BITS[3]
  Bottom 0.2: JP1.38 52,31.68 50.14,31.68 49.54,31.08 49.54,29.74 68.64,10.64 68.64,7.56 GPIO_1.9
MEMSER_IN_BITS[4]
  Bottom 0.2: JP1.36 52.06,34.28 50.14,34.28 49.09,33.23 49.09,29.55 67.31,11.33 GPIO_1.8
MEMSER_IN_BITS[5]
  Bottom 0.2: JP1.35 49.97,34.73 49.95,34.73 48.63,33.41 48.63,29.36 66.04,11.95 66.04,7.62 GPIO_1.7
MEMSER_IN_BITS[6]
  Bottom 0.2: JP1.34 52.02,36.78 50.14,36.78 48.18,34.82 48.18,29.17 64.77,12.58 GPIO_1.6
MEMSER_IN_BITS[7]
  Bottom 0.2: JP1.33 47.72,35.02 47.72,28.99 63.54,13.17 63.54,7.58 GPIO_1.5
MEMSER_IN_READY
  Bottom 0.2: JP1.31 50.54,40.64 46.82,36.92 46.82,28.54 59.69,15.67 GPIO_1.2
MEMSER_IN_VALID
  Bottom 0.2: JP1.32 52.08,39.38 50.04,39.38 47.27,36.61 47.27,28.8 62.23,13.84 GPIO_1.4
MEMSER_OUT_BITS[0]
  Bottom 0.2: GPIO_1.24 87.63,10.09 85.04,12.68 85.04,20.98 85.64,21.58 87.64,21.58 JP2.16
MEMSER_OUT_BITS[1]
  Bottom 0.2: JP2.14 87.64,19.04 87.64,10.78 88.84,9.58 88.84,7.56 GPIO_1.23
MEMSER_OUT_BITS[2]
  Bottom 0.2: GPIO_1.22 85.09,10.13 82.54,12.68 82.54,19.04 JP2.12
MEMSER_OUT_BITS[3]
  Bottom 0.2: JP2.11 83.82,12.1 86.34,9.58 86.34,7.6 GPIO_1.21
MEMSER_OUT_BITS[4]
  Bottom 0.2: GPIO_1.20 82.55,10.17 79.94,12.78 79.94,18.98 JP2.10
MEMSER_OUT_BITS[5]
  Bottom 0.2: JP2.9 81.28,12.14 83.74,9.68 83.74,7.54 GPIO_1.19
MEMSER_OUT_BITS[6]
  Bottom 0.2: GPIO_1.18 80.01,10.11 77.44,12.68 77.44,19.02 JP2.8
MEMSER_OUT_BITS[7]
  Bottom 0.2: JP2.7 78.74,12.08 81.14,9.68 81.14,7.48 GPIO_1.17
MEMSER_OUT_READY
  Bottom 0.2: JP2.5 76.2,12.12 78.64,9.68 78.64,7.52 GPIO_1.15
MEMSER_OUT_VALID
  Bottom 0.2: GPIO_1.16 77.47,10.15 74.94,12.68 74.94,19.06 JP2.6
MISO
  Top 0.2: IC2.15 16.32,58.75 12.23,54.66 12.23,51.6 SD_CARD.8
MOSI
  Top 0.2: IC2.16 19.85,58.02 16.24,58.02 12.69,54.47 12.69,49.52 SD_CARD.10
N$1
  Top 0.2: IC1.1 27.68,74.55 35.24,66.99 35.24,65.09 QSPI.2
N$2
  Top 0.2: IC1.3 27.02,75.84 QSPI.4
N$3
  Top 0.2: IC1.4 28.91,76.5 QSPI.6
N$5
  Top 0.2: IC1.5 30.8,77.15 QSPI.8
N$6
  Top 0.2: IC2.3 25.87,56.72 26.68,56.72 36.83,46.58 UART.2
N$7
  Top 0.2: IC2.4 27.64,57.45 UART.4
N$8
  Top 0.2: IC1.9 34.02,79.75 JTAG.8
N$9
  Top 0.2: IC1.8 35.91,79.09 JTAG.6
N$10
  Top 0.2: IC1.7 35.85,78.45 JTAG.4
N$11
  Top 0.2: IC1.6 33.96,77.8 JTAG.2
N$12
  Top 0.2: IC2.5 30.8,58.09 SD.2
N$13
  Top 0.2: IC2.6 32.7,58.75 SD.4
N$14
  Top 0.2: IC2.7 34.59,59.4 SD.6
N$15
  Top 0.2: IC2.8 36.47,60.05 SD.8
N$17
  Top 0.2: Q5.3 18.82,6.34 D4.C
N$18
  Top 0.2: Q6.3 11.2,6.34 D2.C
N$19
  Top 0.2: Q7.3 16.51,97.56 D3.C
N$20
  Top 0.2: Q8.3 26.67,4.04 D1.C
N$26
  Top 0.406: D1.A 30.48,4.85 R11.1
N$44
  Top 0.406: D2.A 15.24,4.85 R13.1
N$56
  Top 0.2: D3.A 12.7,96.75 R15.1
N$58
  Top 0.406: D4.A 22.86,4.85 R17.1
RST_N  (via drill 0.35)
  Top 0.2: v123.14,89.78 v103.04,89.78
  Bottom 0.2: GPIO_2.35 149.84,88.88 147.84,88.88 147,89.72 123.2,89.72 v123.14,89.78 | v103.04,89.78 101.6,91.22 JP4.16
RTCCLOCK
  Bottom 0.406: J1.5 91.44,102.87 RTC_CLK.2 96.52,97.79 JP4.19
RTCCLOCK_GPIO
  Top 0.406: GPIO_2.38 143.02,98.28 97.64,98.28 95.84,100.08 95.84,101.38 93.08,104.14 RTC_CLK.1
RX
  Top 0.2: IC2.18 16.3,56.8 13.69,54.19 13.69,43.19 6.44,35.94 6.44,27.85 USB-UART_1.2
SCLK
  Top 0.2: IC2.14 19.85,59.32 16.26,59.32 11.78,54.84 11.78,53.69 SD_CARD.6
SD_QSPI_CS
  Bottom 0.2: JP1.23 41.91,59.69 SD.7
SD_QSPI_MISO
  Bottom 0.2: JP1.26 52.06,46.98 50.14,46.98 48.59,48.53 48.59,48.57 42.55,54.61 SD.3
SD_QSPI_MOSI
  Bottom 0.2: JP1.28 52.1,44.48 49.94,44.48 42.35,52.07 SD.1
SD_QSPI_SCK
  Bottom 0.2: JP1.24 52.02,49.48 50.22,49.48 42.55,57.15 SD.5
SDRAM_ADDR_O[0]
  Bottom 0.2: SDRAM_1.23 139.71,64.78 137.74,64.78 133.94,68.58 JP3.29
SDRAM_ADDR_O[1]
  Bottom 0.2: JP3.28 130.78,67.28 134.6,67.28 137.55,64.33 137.6,64.33 SDRAM_1.22
SDRAM_ADDR_O[2]
  Bottom 0.2: SDRAM_1.21 139.75,62.28 137.74,62.28 135.24,64.78 130.82,64.78 JP3.26
SDRAM_ADDR_O[3]
  Bottom 0.2: JP3.24 130.86,62.28 137.1,62.28 137.55,61.83 137.56,61.83 SDRAM_1.20
SDRAM_ADDR_O[4]
  Bottom 0.2: SDRAM_1.19 139.69,59.68 137.74,59.68 136.46,60.96 JP3.23
SDRAM_ADDR_O[5]
  Bottom 0.2: JP3.22 130.8,59.68 137.1,59.68 137.55,59.23 137.62,59.23 SDRAM_1.18
SDRAM_ADDR_O[6]
  Bottom 0.2: SDRAM_1.17 139.73,57.18 137.74,57.18 136.5,58.42 JP3.21
SDRAM_ADDR_O[7]
  Bottom 0.2: JP3.20 130.84,57.18 137.1,57.18 137.55,56.73 137.58,56.73 SDRAM_1.16
SDRAM_ADDR_O[8]
  Bottom 0.2: SDRAM_1.15 139.67,54.58 137.84,54.58 136.54,55.88 JP3.19
SDRAM_ADDR_O[9]
  Bottom 0.2: JP3.18 130.78,54.58 137.19,54.58 SDRAM_1.14
SDRAM_ADDR_O[10]
  Bottom 0.2: SDRAM_1.13 139.71,52.08 137.74,52.08 136.48,53.34 JP3.17
SDRAM_ADDR_O[11]
  Bottom 0.2: JP3.16 130.72,51.98 137.2,51.98 137.55,51.63 137.6,51.63 SDRAM_1.12
SDRAM_ADDR_O[12]
  Bottom 0.2: SDRAM_1.11 139.75,49.58 130.86,49.58 JP3.14
SDRAM_BA_O[0]
  Bottom 0.2: SDRAM_1.25 139.77,67.38 137.64,67.38 133.9,71.12 JP3.31
SDRAM_BA_O[1]
  Bottom 0.2: JP3.30 130.84,69.88 134.5,69.88 137.45,66.93 137.54,66.93 SDRAM_1.24
SDRAM_CAS_O
  Bottom 0.2: SDRAM_1.5 139.67,41.88 137.84,41.88 136.6,40.64 JP3.7
SDRAM_CKE_O
  Bottom 0.2: JP3.4 130.76,36.78 137.11,36.78 SDRAM_1.2
SDRAM_CLK_O
  Bottom 0.2: SDRAM_1.1 137.15,34.28 130.8,34.28 JP3.2
SDRAM_CS_O
  Bottom 0.2: SDRAM_1.3 139.71,39.38 137.84,39.38 136.56,38.1 JP3.5
SDRAM_DATA_I[0]
  Bottom 0.2: SDRAM_2.25 60.4,100.18 70.5,90.08 72.3,90.08 JP4.38
SDRAM_DATA_I[1]
  Bottom 0.2: SDRAM_2.24 59.14,103.81 59.14,100.8 70.31,89.63 74.39,89.63 JP4.36
SDRAM_DATA_I[2]
  Bottom 0.2: JP4.35 77.54,92.64 77.54,90.98 75.73,89.17 70.12,89.17 57.86,101.43 SDRAM_2.23
SDRAM_DATA_I[3]
  Bottom 0.2: SDRAM_2.22 56.64,103.77 56.64,101.68 69.6,88.72 75.92,88.72 78.64,91.44 JP4.34
SDRAM_DATA_I[4]
  Bottom 0.2: JP4.33 80.04,92.68 80.04,90.78 79.34,90.08 77.92,90.08 76.11,88.26 69.41,88.26 56.19,101.49 56.19,101.68 SDRAM_2.21
SDRAM_DATA_I[5]
  Bottom 0.2: SDRAM_2.20 54.04,103.83 54.04,101.88 68.11,87.81 76.3,87.81 78.11,89.63 79.53,89.63 80.49,90.59 80.49,90.65 JP4.32
SDRAM_DATA_I[6]
  Bottom 0.2: JP4.31 82.64,92.62 82.64,90.78 81.74,89.88 80.42,89.88 79.72,89.17 78.3,89.17 76.48,87.36 67.92,87.36 53.59,101.69 53.59,101.74 SDRAM_2.19
SDRAM_DATA_I[7]
  Bottom 0.2: SDRAM_2.18 51.54,103.79 51.54,101.98 66.62,86.9 79.4,86.9 83.09,90.59 83.09,90.71 JP4.30
SDRAM_DATA_I[8]
  Bottom 0.2: JP4.29 85.14,92.66 85.14,91.18 80.41,86.45 66.34,86.45 SDRAM_2.17
SDRAM_DATA_I[9]
  Bottom 0.2: SDRAM_2.16 49.04,103.75 49.04,101.78 64.83,85.99 80.91,85.99 JP4.28
SDRAM_DATA_I[10]
  Bottom 0.2: JP4.26 83,85.54 64.64,85.54 48.59,101.59 48.59,101.66 SDRAM_2.15
SDRAM_DATA_I[11]
  Bottom 0.2: SDRAM_2.14 46.44,103.81 46.44,101.78 63.13,85.09 85.09,85.09 JP4.24
SDRAM_DATA_I[12]
  Bottom 0.2: JP4.23 92.64,92.78 92.64,90.68 86.59,84.63 62.95,84.63 45.99,101.59 45.99,101.72 SDRAM_2.13
SDRAM_DATA_I[13]
  Bottom 0.2: JP4.22 93.09,90.55 93.09,90.49 86.78,84.18 61.64,84.18 43.94,101.88 43.94,103.77 SDRAM_2.12
SDRAM_DATA_I[14]
  Bottom 0.2: JP4.21 95.24,92.72 95.24,90.78 88.18,83.72 61.45,83.72 SDRAM_2.11
SDRAM_DATA_I[15]
  Bottom 0.2: JP4.20 95.69,90.61 95.69,90.59 88.37,83.27 61.26,83.27 43.25,101.28 42.04,101.28 41.34,101.98 41.34,103.83 SDRAM_2.10
SDRAM_DATA_O[0]
  Bottom 0.2: JP4.11 106.02,93.32 106.02,92.53 105.34,91.85 105.34,90.68 97.48,82.82 59.81,82.82 SDRAM_2.9
SDRAM_DATA_O[1]
  Bottom 0.2: JP4.10 108.39,90.61 108.39,90.59 99.71,81.91 56.21,81.91 36.24,101.88 36.24,103.79 SDRAM_2.8
SDRAM_DATA_O[2]
  Bottom 0.2: JP4.9 108.56,93.32 108.56,92.53 107.94,91.91 107.94,90.78 99.52,82.36 57.73,82.36 SDRAM_2.7
SDRAM_DATA_O[3]
  Bottom 0.2: JP4.8 101.32,81 55.84,81 35.56,101.28 34.64,101.28 33.74,102.18 33.74,103.83 SDRAM_2.6
SDRAM_DATA_O[4]
  Bottom 0.2: JP4.7 110.54,92.76 110.54,90.98 101.01,81.45 56.02,81.45 35.79,101.69 35.79,101.76 SDRAM_2.5
SDRAM_DATA_O[5]
  Bottom 0.2: SDRAM_2.4 31.24,103.87 31.24,101.78 32.65,100.37 35.18,100.37 55.46,80.09 102.99,80.09 113.59,90.69 113.59,90.73 JP4.6
SDRAM_DATA_O[6]
  Bottom 0.2: JP4.5 113.14,92.82 113.14,90.88 102.81,80.55 55.65,80.55 35.37,100.83 34.18,100.83 SDRAM_2.3
SDRAM_DATA_O[7]
  Bottom 0.2: JP4.4 116.09,90.69 104.59,79.18 54.98,79.18 34.7,99.46 31.06,99.46 28.64,101.88 28.64,103.81 SDRAM_2.2
SDRAM_DATA_O[8]
  Bottom 0.2: SDRAM_2.1 30.79,101.68 30.79,101.59 32.46,99.92 34.99,99.92 55.27,79.64 104.4,79.64 115.64,90.88 115.64,94.68 116.24,95.28 117.54,95.28 118.04,94.78 118.04,92.68 119.28,91.44 JP4.2
SDRAM_DATA_O[9]
  Bottom 0.2: SDRAM_1.32 138.43,76.8 132.65,82.58 130.84,82.58 JP3.40
SDRAM_DATA_O[10]
  Bottom 0.2: SDRAM_1.31 139.75,74.98 137.74,74.98 132.64,80.08 130.88,80.08 JP3.38
SDRAM_DATA_O[11]
  Bottom 0.2: JP3.36 130.72,77.38 134.7,77.38 137.55,74.53 137.56,74.53 SDRAM_1.30
SDRAM_DATA_O[12]
  Bottom 0.2: SDRAM_1.29 139.69,72.38 137.94,72.38 134.12,76.2 JP3.35
SDRAM_DATA_O[13]
  Bottom 0.2: JP3.34 130.86,74.98 134.57,74.98 SDRAM_1.28
SDRAM_DATA_O[14]
  Bottom 0.2: SDRAM_1.27 139.73,69.88 137.74,69.88 133.96,73.66 JP3.33
SDRAM_DATA_O[15]
  Bottom 0.2: JP3.32 130.8,72.38 134.6,72.38 137.55,69.43 137.58,69.43 SDRAM_1.26
SDRAM_DQM_O[0]
  Bottom 0.2: SDRAM_1.10 134.02,48.26 132.84,47.08 130.9,47.08 JP3.12
SDRAM_DQM_O[1]
  Bottom 0.2: SDRAM_1.9 139.79,47.08 137.88,47.08 136.53,45.73 JP3.11
SDRAM_DQM_O[2]
  Bottom 0.2: JP3.10 130.84,44.48 137.19,44.48 SDRAM_1.8
SDRAM_DQM_O[3]
  Bottom 0.2: SDRAM_1.7 139.73,44.48 137.84,44.48 136.54,43.18 JP3.9
SDRAM_DRIVE_O
  Bottom 0.2: JP4.40 69.78,91.44 61.74,99.48 61.74,103.75 SDRAM_2.26
SDRAM_RAS_O
  Bottom 0.2: JP3.6 130.82,39.38 137.17,39.38 SDRAM_1.4
SDRAM_WE_O
  Bottom 0.2: JP3.8 130.78,41.88 137.13,41.88 SDRAM_1.6
SDRAMCLOCK
  Bottom 0.406: J2.5 69.85,105.99 71.64,107.78 91.84,107.78 95.84,103.78 95.84,103.68 97.92,101.6 SDRAM_CLK.2 99.06,95.86 100.28,94.64 100.28,92.66 JP4.18
SDRAMCLOCK_GPIO
  Top 0.406: GPIO_2.37 152.74,94.32 152.74,96.78 140.04,109.48 104.4,109.48 SDRAM_CLK.1
SYS_CLK
  Bottom 0.406: J4.5 135.89,105.93 133.94,107.88 112.96,107.88 SYS_CLK.2 105.46,100.38 105.46,92.76 JP4.14
TCK
  Top 0.2: IC1.14 16.8,78.45 JTAG_20_PIN.9
TDI  (via drill 0.35)
  Top 0.2: IC1.12 17.21,79.75 v17.16,79.8
  Bottom 0.2: v17.16,79.8 10.37,79.8 JTAG_20_PIN.5
TDO
  Top 0.2: IC1.13 16.92,79.09 8.94,87.08 8.94,91.39 JTAG_20_PIN.13
TMS
  Top 0.2: JTAG_20_PIN.7 14.91,77.8 IC1.15
TX  (via drill 0.35)
  Top 0.2: IC2.17 16.3,57.45 13.14,54.28 13.14,43.98 v8.94,39.78
  Bottom 0.2: v8.94,39.78 8.94,30.44 USB-UART_1.4
UART_RXD
  Bottom 0.2: JP1.30 52.04,41.88 43.21,41.88 UART.1
UART_TXD
  Bottom 0.2: JP1.29 44.45,43.18 UART.3
VDD
  Top 0.406: POWER.2 47.12,22.73 C13.1 C12.1 54.79,22.73 55.74,23.68 55.74,27.58 | 55.74,27.58 54.44,28.88 52.4,28.88 JP1.39 | 55.74,27.58 55.74,60.48 | JP1.13 52.12,62.18 54.04,62.18 55.74,60.48 | JP4.13 102.82,92.66 102.82,90.66 101.14,88.98 | 55.74,60.48 55.74,82.98 61.74,88.98 67.44,88.98 | 67.44,88.98 101.14,88.98 | 101.14,88.98 121.14,88.98 126.34,83.78 | 126.34,54.48 128.74,52.08 130.8,52.08 JP3.15 | 126.34,83.78 126.34,54.48 | 126.34,54.48 126.34,26.88 122.34,22.88 | 122.34,22.88 89.64,22.88 87.64,20.88 87.64,19.06 JP2.13 | 122.34,22.88 120.74,21.28 120.74,19.14 JP2.39 | 126.34,83.78 127.44,82.68 130.68,82.68 JP3.39 | 67.44,88.98 69.54,91.08 69.54,92.68 70.84,93.98 JP4.39
  Bottom 0.406: POWER.2 40.64,26.67 40.64,12.7 POWER_LED.1
  pour Top: 41.84,27.48 47.34,21.98 52.84,21.98 54.64,21.98 56.24,23.58 56.24,82.48 61.74,87.98 62.14,88.38 71.04,88.38 120.44,88.38 125.34,83.48 125.34,27.28 122.04,23.98 89.64,23.98 87.54,21.88 87.54,21.18 87.64,21.08 88.64,21.08 90.04,22.48 122.64,22.48 124.14,23.98 127.04,26.88 127.04,32.08 127.04,83.78 121.64,89.18 121.44,89.38 114.54,89.38 60.84,89.38 55.04,83.58 55.04,79.98 55.04,23.78 54.64,23.38 54.54,23.28 48.04,23.28 42.84,28.48 42.14,28.48 41.84,28.18
VDD_1.8_1
  Top 0.406: IC5.2 IC5.4 35.43,30.48 C10.1 36.96,30.35 POWER.1
VDD_1.8_2
  Top 0.406: IC3.2 IC3.4 35.43,21.59 C6.1 37.52,21.46 39.37,23.31 POWER.3
VDD_3V3
  Top 0.2: IC1.19 21.33,75.2 21.44,75.08 | IC2.19 19.96,56.18 21.64,56.18
  Top 0.406: IC5.3 23.75,28.19 C9.1 22.86,27.7 20.44,25.28 20.44,25.18 | IC3.3 23.75,19.3 C5.1 22.83,20.19 20.44,22.58 20.44,25.18 | R13.2 16.5,10.28 18.59,10.28 20.01,8.86 Q5.1 22.51,8.67 R17.2 | R11.2 29.04,7.58 24.3,7.58 R17.2 | 3.3V_GPIO.1 17.78,43.22 20.45,45.89 C2.1 21.64,53.26 21.64,56.18 21.64,70.98 | 21.44,75.08 21.64,74.88 21.64,70.98 | C4.1 21.5,71.12 21.64,70.98 | 2.14,74.53 JTAG_20_PIN.2 JTAG_20_PIN.1 | 2.14,54.68 2.14,44.85 2.17,44.82 2.17,26.85 4.34,24.68 12.15,24.68 | 2.14,54.68 2.14,72.38 | 2.14,72.38 2.14,74.53 | 2.14,74.53 2.14,91.88 4.24,93.98 11.3,93.98 R15.2 | 3.3V_GPIO.1 18.95,26.67 20.44,25.18 | 3.3V_GPIO.1 16.33,26.67 14.34,24.68 | 14.34,24.68 14.34,20.08 R16.2 22.86,11.56 R17.2 | 14.34,24.68 12.15,24.68 | 12.15,24.68 USB-UART_1.3 | FLASH.2 FLASH.1 2.14,72.38 | SD_CARD.2 SD_CARD.1 2.21,54.61 2.14,54.68
  pour Top: 18.54,26.38 20.14,24.78 20.14,22.38 23.34,19.18 26.44,19.18 26.44,19.68 23.84,19.68 20.74,22.78 20.74,24.78 23.94,27.98 26.34,27.98 26.34,28.28 26.14,28.48 23.04,28.48 21.04,26.48 18.54,26.48
  pour Top: 17.44,27.18 17.44,43.68 18.44,44.68 20.14,46.38 20.14,47.18 20.14,52.28 20.84,52.98 21.34,53.48 21.34,55.48 21.34,75.08 21.44,75.18 21.54,75.18 21.64,75.18 21.84,74.98 21.84,74.28 21.84,53.08 20.84,52.08 20.84,45.98 18.14,43.28 18.14,42.78 18.14,27.28 18.04,27.18
  pour Top: 16.24,27.18 13.94,24.88 4.54,24.88 2.54,26.88 2.54,91.78 4.44,93.68 4.44,94.08 4.34,94.18 3.94,94.18 1.74,91.98 1.74,89.38 1.84,89.28 1.84,26.38 4.04,24.18 14.34,24.18 16.74,26.58 16.74,27.08 16.64,27.18
VDD_3V3_GPIO
  Top 0.406: GPIO_2.29 149.91,81.33 148.09,81.33 148.04,81.38 147.64,81.38 144.74,78.48 144.74,15.58 133.24,4.08 97.52,4.08 | 97.52,4.08 48.24,4.08 37.14,15.18 24.34,15.18 17.78,21.74 3.3V_GPIO.2 | GPIO_1.29 97.52,4.08
  pour Top: 147.24,81.88 143.94,78.58 143.94,75.48 143.94,15.88 135.64,7.58 132.34,4.28 100.74,4.28 49.04,4.28 44.14,9.18 37.54,15.78 27.44,15.78 24.64,15.78 18.64,21.78 18.44,21.98 18.44,23.48 18.14,23.78 17.54,23.78 17.14,23.38 17.14,22.08 17.14,21.38 22.64,15.88 23.84,14.68 27.24,14.68 36.84,14.68 45.54,5.98 48.64,2.88 82.14,2.88 133.34,2.88 144.84,14.38 145.44,14.98 145.44,17.38 145.44,78.08 146.34,78.98 147.44,80.08 147.44,80.58 147.44,81.68
VDD_LED
  Top 0.406: Q8.1 29.34,10.38 R10.2 33.02,12.7 POWER_LED.2
VDDO
  Top 0.152: IC1.10 25.81,80.47 25.8,80.43
  Top 0.2: IC2.10 23.86,61.34 | IC2.2 23.86,56.15 | IC1.2 25.78,75.18 23.84,75.18
  Top 0.406: 25.8,80.43 24.41,80.43 23.84,79.86 23.84,75.18 23.84,70.86 | 23.84,56.16 23.84,53.5 C1.1 25.27,51.33 32.2,44.4 32.25,44.4 33.07,43.58 48.66,43.58 JP1.27 48.34,48.18 48.34,78.68 | 23.84,56.16 23.84,61.36 | 23.84,61.36 23.84,70.86 | C3.1 25.01,70.86 23.84,70.86 | 23.86,61.34 23.84,61.36 | 23.86,56.15 23.84,56.16 | 69.98,16.64 C14.1 C11.1 47.08,16.64 41.91,21.81 POWER.4 | JP2.25 99,15.18 | 99,15.18 71.54,15.18 70.08,16.64 69.98,16.64 | 99,15.18 129.54,15.18 134.64,20.28 134.64,30.46 | JP3.1 134.64,30.46 | 134.64,60.94 JP3.25 | 134.64,30.46 134.64,60.94 | 134.64,60.94 134.64,92.38 130.54,96.48 121.88,96.48 | JP4.1 121.88,96.48 | 121.88,96.48 88.86,96.48 | 88.86,96.48 JP4.27 | 88.86,96.48 56.94,96.48 48.34,87.88 48.34,78.68 | JP1.1 48.4,78.74 48.34,78.68 | 69.98,16.64 JP2.1
  Bottom 0.406: POWER.4 41.91,11.43 POWER_LED.3
  pour Top: 41.14,25.18 41.14,21.38 46.54,15.98 70.14,15.98 71.24,14.88 71.54,14.58 77.24,14.58 129.84,14.58 135.24,19.98 135.24,93.18 132.04,96.38 131.64,96.78 124.24,96.78 56.24,96.78 48.04,88.58 48.04,47.78 49.94,45.88 50.14,46.08 50.14,46.58 50.14,47.18 48.94,48.38 48.94,87.48 57.24,95.78 130.14,95.78 133.84,92.08 133.84,89.58 133.84,20.58 129.14,15.88 71.74,15.88 71.44,16.18 70.54,17.08 66.14,17.08 47.54,17.08 45.04,19.58 42.54,22.08 42.54,23.88 42.54,25.18 42.14,25.58 41.54,25.58
  pour Top: 50.04,45.38 48.44,43.78 45.84,43.78 33.14,43.78 27.84,49.08 25.64,51.28 25.64,51.88 25.64,51.98 24.04,53.58 24.04,79.68 24.44,80.08 24.44,80.68 23.64,79.88 23.64,79.48 23.64,53.58 24.84,52.38 25.14,52.08 25.14,51.38 33.24,43.28 36.54,43.28 48.74,43.28 49.94,44.48 50.54,45.08 50.54,45.18 50.34,45.38
VDDO_LED  (via drill 0.35)
  Top 0.406: v16.14,12.7 R12.2 12.39,10.99 Q6.1
  Bottom 0.406: POWER_LED.4 25.65,7.62 20.57,12.7 v16.14,12.7

## Text on the board
tNames: RTC_CLK | SYS_CLK | SDRAM_CLK | CHILD_CLK | 0 1 2 3 4 | TDI | TDO | 1 | TCK | TMS | CS | SCK | SCK | MISO | MISO | MOSI | MOSI | CS | CS | SCK | MISO | MOSI | SCK | TX | MISO | RX | MOSI | 1 | CS | VDD | VDDO | RX | TX | VDD | VDDO | 1 | Rocket32_TRASIO Demo Kit / Copyright © UEC Pham Lab / 2022 | 3.3V | VDDO | VDD